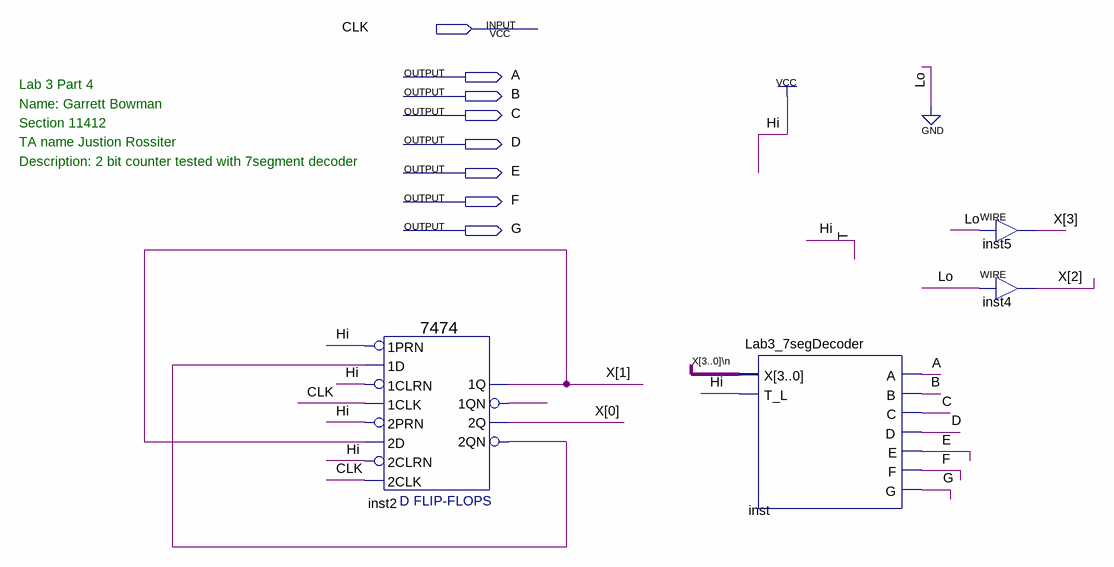
[diagram p0: schematic sheet]
// Quartus schematic Lab3Counter7seg.bdf as structural Verilog: 4 symbols, 8 pins
module Lab3Counter7seg (
  input  CLK,
  output A,
  output B,
  output C,
  output D,
  output E,
  output F,
  output G
);

  wire inst2_1qn, inst2_2qn, \X[3..0]\n ;
  wire [3:0] X;

  \7474  inst2 (
    .\2D (X[1]), .\2PRN (1'b1), .\1CLK (CLK), .\1D (inst2_2qn), .\1PRN (1'b1), .\2CLK (CLK), .\2CLRN (1'b1),
    .\1CLRN (1'b1), .\1QN (inst2_1qn), .\2Q (X[0]), .\2QN (inst2_2qn), .\1Q (X[1]));
  Lab3_7segDecoder inst (.X({4{\X[3..0]\n }}), .T_L(1'b1), .A(A), .B(B), .C(C), .D(D), .E(E), .F(F), .G(G));
  assign X[3] = 1'b0;  // WIRE inst5
  assign X[2] = 1'b0;  // WIRE inst4

  // Notes on the sheet:
  //   Lab 3 Part 4
  //   Name: Garrett Bowman
  //   Section 11412
  //   TA name Justion Rossiter
  //   Description: 2 bit counter tested with 7segment decoder
endmodule
